# EAGLE board A20-SOM-EVB_Rev_B (EAGLE 4.16), part 1 of 3
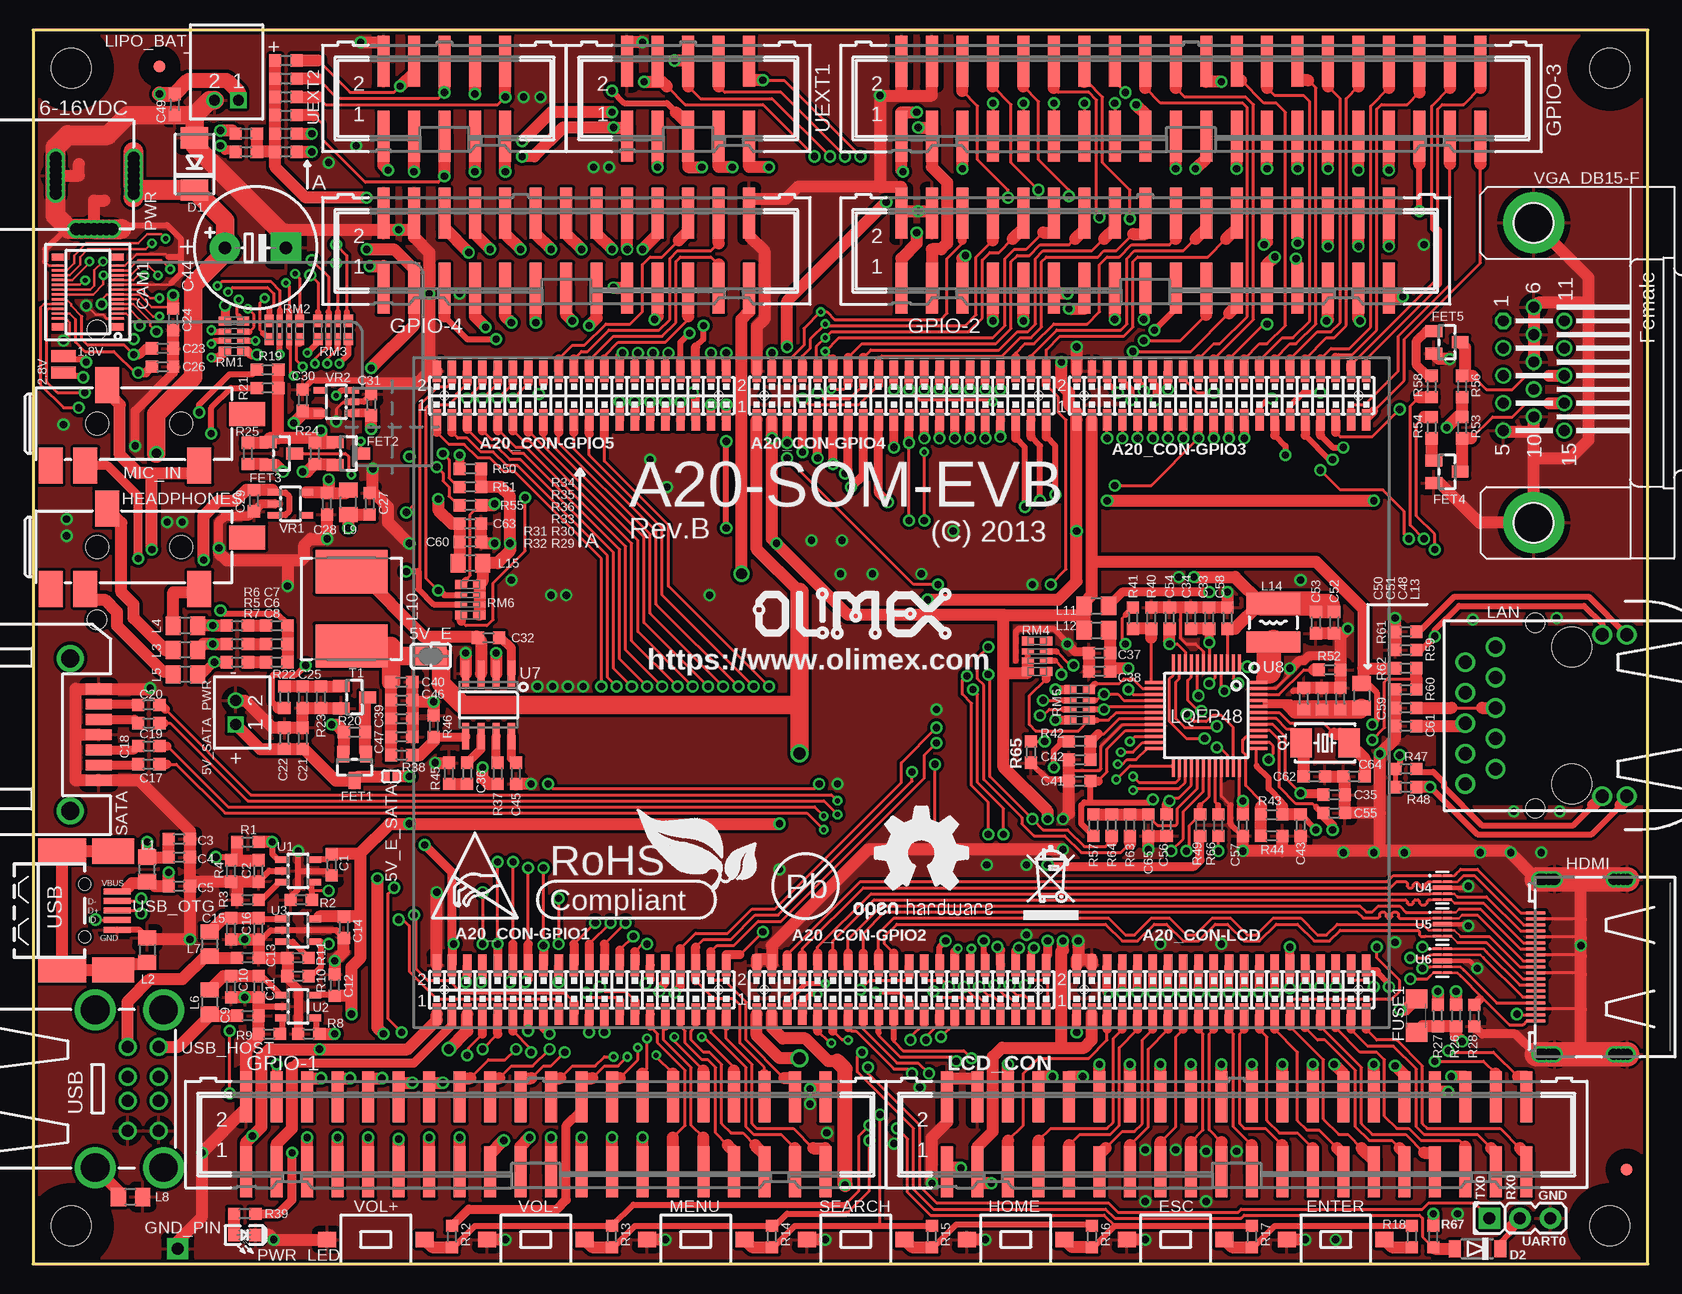
[diagram p5: board, top side]
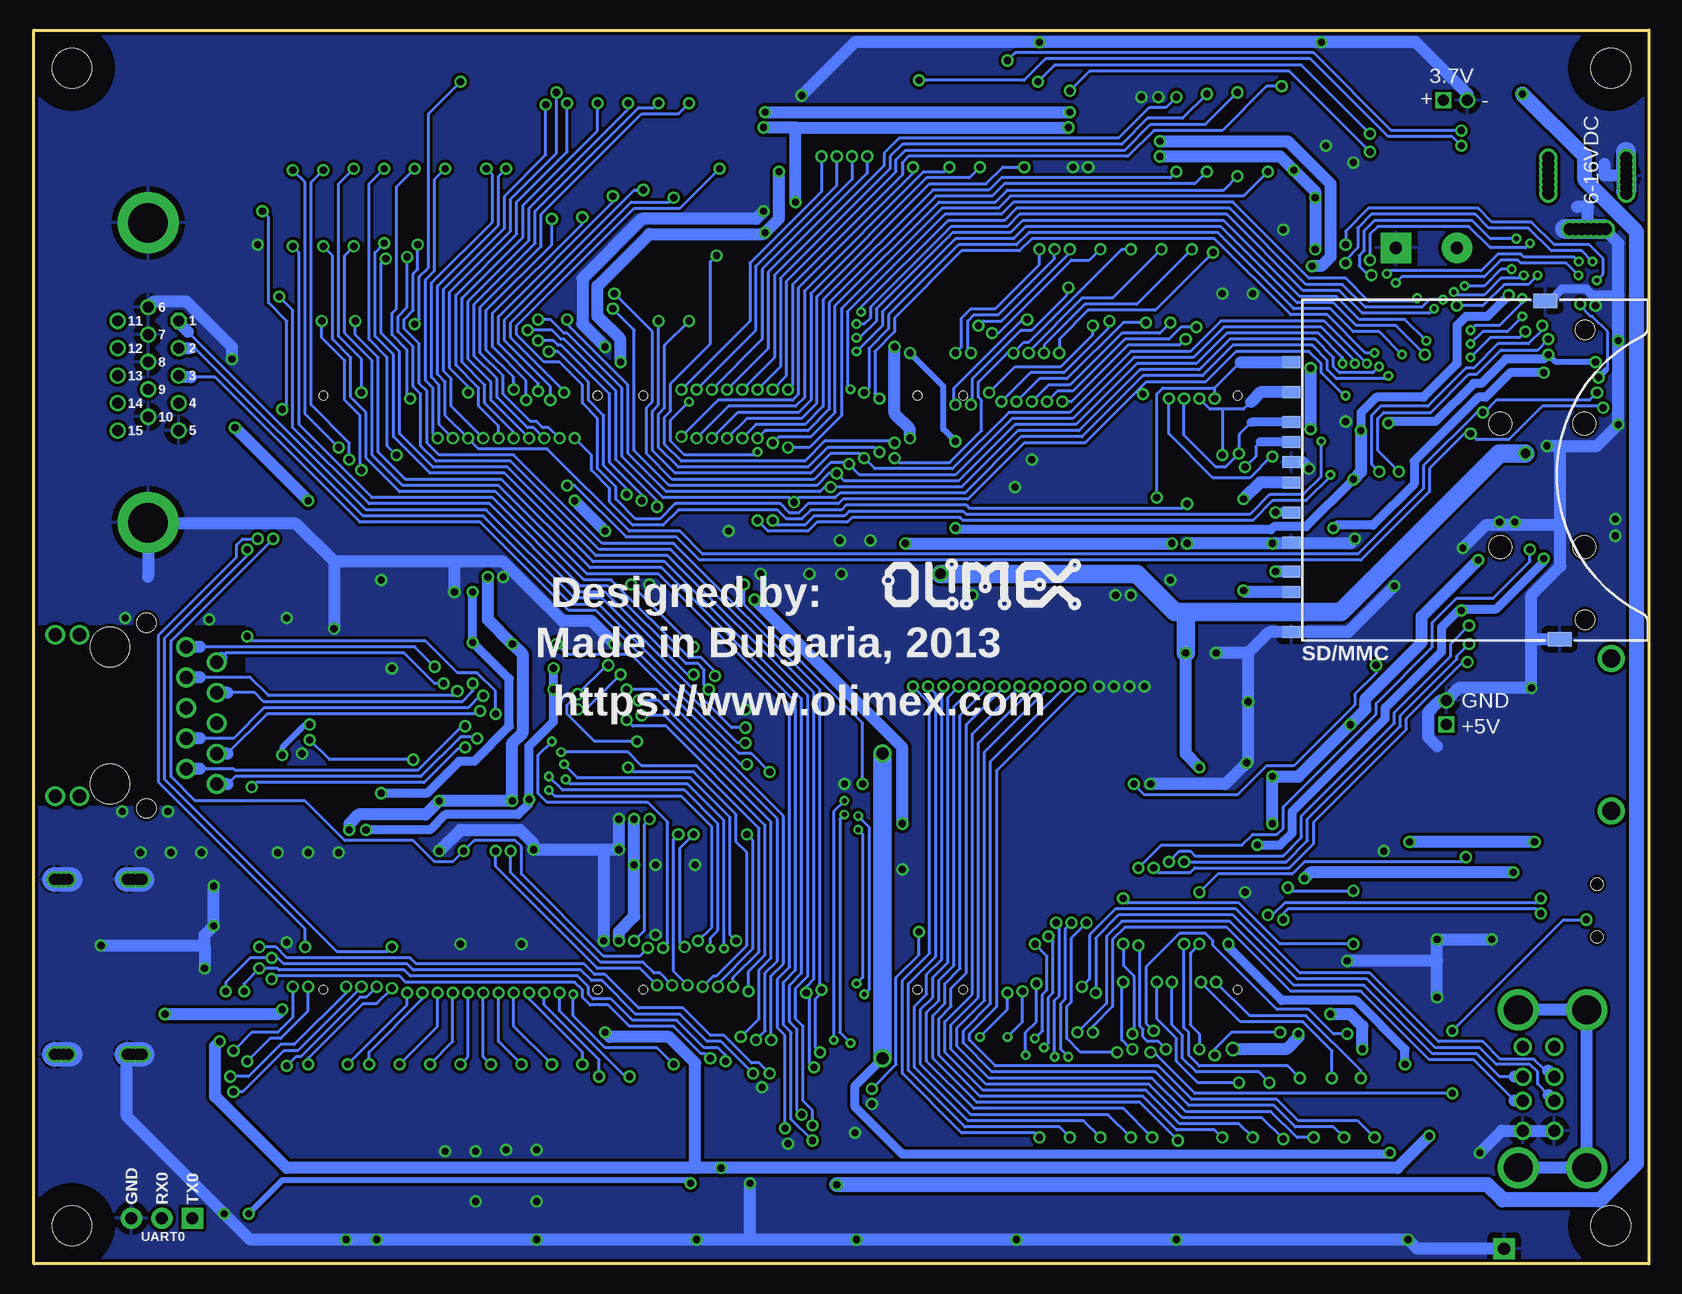
[diagram p6: board, bottom side, seen from below]

Size 134.62 x 102.87 mm. Coordinates in mm from the lower left corner, seen from the top.
Outline: 0,102.87 0,0 134.62,0 134.62,102.87 0,102.87
Copper layers (1+16): Top 0.035mm / dielectric 1.5mm / Bottom 0.035mm
Design rules "default": minimum track width 8mil, minimum drill 0.4mm, track to track 7mil, track to pad 7mil, pad to pad 7mil, via to via 7mil, smd to smd 1mil, copper to edge 10mil, drill to drill 8mil, minimum pad ring 8mil, minimum via ring 8mil, stop-mask expansion 4mil, vias tented up to drill 25mil, thermal gap 20mil
Holes 3.3 mm at 3.17,3.17 131.44,3.17 131.44,99.69 3.17,99.69
tRestrict: area 0,0 to 6.3,6.3; area 128.3,0 to 134.6,6.3; area 128.3,96.5 to 134.6,102.9; area 0,96.5 to 6.3,102.9
bRestrict: area 0,0 to 6.3,6.3; area 128.3,0 to 134.6,6.3; area 128.3,96.5 to 134.6,102.9; area 0,96.5 to 6.3,102.9

## Footprints (pad centres in the part's own frame; a part is rotated, then mirrored left to right if it is on the bottom)
SMD80/40 = smd 2.032 x 1.016: P$1 0,0
SJ-CLOSE = smd 1.168 x 1.6: 1 -0.762,0; 2 0.762,0
SJ_1_SMALLER = smd 0.508 x 0.762: 1 -0.381,0; 2 0.381,0
DW02S = drill 0.9 square: 1 -1,0 | drill 0.9 round: 2 1,0
A20-SOM-EVB = smd 0.7 x 1.8: 1-1 -38.735,-26.797; 1-2 -38.735,-22.733; 1-3 -37.465,-26.797; 1-4 -37.465,-22.733; 1-5 -36.195,-26.797; 1-6 -36.195,-22.733; 1-7 -34.925,-26.797; 1-8 -34.925,-22.733; 1-9 -33.655,-26.797; 1-10 -33.655,-22.733; 1-11 -32.385,-26.797; 1-12 -32.385,-22.733; 1-13 -31.115,-26.797; 1-14 -31.115,-22.733; 1-15 -29.845,-26.797; 1-16 -29.845,-22.733; 1-17 -28.575,-26.797; 1-18 -28.575,-22.733; 1-19 -27.305,-26.797; 1-20 -27.305,-22.733; 1-21 -26.035,-26.797; 1-22 -26.035,-22.733; 1-23 -24.765,-26.797; 1-24 -24.765,-22.733; 1-25 -23.495,-26.797; 1-26 -23.495,-22.733; 1-27 -22.225,-26.797; 1-28 -22.225,-22.733; 1-29 -20.955,-26.797; 1-30 -20.955,-22.733; 1-31 -19.685,-26.797; 1-32 -19.685,-22.733; 1-33 -18.415,-26.797; 1-34 -18.415,-22.733; 1-35 -17.145,-26.797; 1-36 -17.145,-22.733; 1-37 -15.875,-26.797; 1-38 -15.875,-22.733; 1-39 -14.605,-26.797; 1-40 -14.605,-22.733; 2-1 -12.065,-26.797; 2-2 -12.065,-22.733; 2-3 -10.795,-26.797; 2-4 -10.795,-22.733; 2-5 -9.525,-26.797; 2-6 -9.525,-22.733; 2-7 -8.255,-26.797; 2-8 -8.255,-22.733; 2-9 -6.985,-26.797; 2-10 -6.985,-22.733; 2-11 -5.715,-26.797; 2-12 -5.715,-22.733; 2-13 -4.445,-26.797; 2-14 -4.445,-22.733; 2-15 -3.175,-26.797; 2-16 -3.175,-22.733; 2-17 -1.905,-26.797; 2-18 -1.905,-22.733; 2-19 -0.635,-26.797; 2-20 -0.635,-22.733; 2-21 0.635,-26.797; 2-22 0.635,-22.733; 2-23 1.905,-26.797; 2-24 1.905,-22.733; 2-25 3.175,-26.797; 2-26 3.175,-22.733; 2-27 4.445,-26.797; 2-28 4.445,-22.733; 2-29 5.715,-26.797; 2-30 5.715,-22.733; 2-31 6.985,-26.797; 2-32 6.985,-22.733; 2-33 8.255,-26.797; 2-34 8.255,-22.733; 2-35 9.525,-26.797; 2-36 9.525,-22.733; 2-37 10.795,-26.797; 2-38 10.795,-22.733; 2-39 12.065,-26.797; 2-40 12.065,-22.733; 3-1 14.605,22.733; 3-2 14.605,26.797; 3-3 15.875,22.733; 3-4 15.875,26.797; 3-5 17.145,22.733; 3-6 17.145,26.797; 3-7 18.415,22.733; 3-8 18.415,26.797; 3-9 19.685,22.733; 3-10 19.685,26.797; 3-11 20.955,22.733; 3-12 20.955,26.797; 3-13 22.225,22.733; 3-14 22.225,26.797; 3-15 23.495,22.733; 3-16 23.495,26.797; 3-17 24.765,22.733; 3-18 24.765,26.797; 3-19 26.035,22.733; 3-20 26.035,26.797; 3-21 27.305,22.733; 3-22 27.305,26.797; 3-23 28.575,22.733; 3-24 28.575,26.797; 3-25 29.845,22.733; 3-26 29.845,26.797; 3-27 31.115,22.733; 3-28 31.115,26.797; 3-29 32.385,22.733; 3-30 32.385,26.797; 3-31 33.655,22.733; 3-32 33.655,26.797; 3-33 34.925,22.733; 3-34 34.925,26.797; 3-35 36.195,22.733; 3-36 36.195,26.797; 3-37 37.465,22.733; 3-38 37.465,26.797; 3-39 38.735,22.733; 3-40 38.735,26.797; 4-1 -12.065,22.733; 4-2 -12.065,26.797; 4-3 -10.795,22.733; 4-4 -10.795,26.797; 4-5 -9.525,22.733; 4-6 -9.525,26.797; 4-7 -8.255,22.733; 4-8 -8.255,26.797; 4-9 -6.985,22.733; 4-10 -6.985,26.797; 4-11 -5.715,22.733; 4-12 -5.715,26.797; 4-13 -4.445,22.733; 4-14 -4.445,26.797; 4-15 -3.175,22.733; 4-16 -3.175,26.797; 4-17 -1.905,22.733; 4-18 -1.905,26.797; 4-19 -0.635,22.733; 4-20 -0.635,26.797; 4-21 0.635,22.733; 4-22 0.635,26.797; 4-23 1.905,22.733; 4-24 1.905,26.797; 4-25 3.175,22.733; 4-26 3.175,26.797; 4-27 4.445,22.733; 4-28 4.445,26.797; 4-29 5.715,22.733; 4-30 5.715,26.797; 4-31 6.985,22.733; 4-32 6.985,26.797; 4-33 8.255,22.733; 4-34 8.255,26.797; 4-35 9.525,22.733; 4-36 9.525,26.797; 4-37 10.795,22.733; 4-38 10.795,26.797; 4-39 12.065,22.733; 4-40 12.065,26.797; 5-1 -38.735,22.733; 5-2 -38.735,26.797; 5-3 -37.465,22.733; 5-4 -37.465,26.797; 5-5 -36.195,22.733; 5-6 -36.195,26.797; 5-7 -34.925,22.733; 5-8 -34.925,26.797; 5-9 -33.655,22.733; 5-10 -33.655,26.797; 5-11 -32.385,22.733; 5-12 -32.385,26.797; 5-13 -31.115,22.733; 5-14 -31.115,26.797; 5-15 -29.845,22.733; 5-16 -29.845,26.797; 5-17 -28.575,22.733; 5-18 -28.575,26.797; 5-19 -27.305,22.733; 5-20 -27.305,26.797; 5-21 -26.035,22.733; 5-22 -26.035,26.797; 5-23 -24.765,22.733; 5-24 -24.765,26.797; 5-25 -23.495,22.733; 5-26 -23.495,26.797; 5-27 -22.225,22.733; 5-28 -22.225,26.797; 5-29 -20.955,22.733; 5-30 -20.955,26.797; 5-31 -19.685,22.733; 5-32 -19.685,26.797; 5-33 -18.415,22.733; 5-34 -18.415,26.797; 5-35 -17.145,22.733; 5-36 -17.145,26.797; 5-37 -15.875,22.733; 5-38 -15.875,26.797; 5-39 -14.605,22.733; 5-40 -14.605,26.797; LCD-1 14.605,-26.797; LCD-2 14.605,-22.733; LCD-3 15.875,-26.797; LCD-4 15.875,-22.733; LCD-5 17.145,-26.797; LCD-6 17.145,-22.733; LCD-7 18.415,-26.797; LCD-8 18.415,-22.733; LCD-9 19.685,-26.797; LCD-10 19.685,-22.733; LCD-11 20.955,-26.797; LCD-12 20.955,-22.733; LCD-13 22.225,-26.797; LCD-14 22.225,-22.733; LCD-15 23.495,-26.797; LCD-16 23.495,-22.733; LCD-17 24.765,-26.797; LCD-18 24.765,-22.733; LCD-19 26.035,-26.797; LCD-20 26.035,-22.733; LCD-21 27.305,-26.797; LCD-22 27.305,-22.733; LCD-23 28.575,-26.797; LCD-24 28.575,-22.733; LCD-25 29.845,-26.797; LCD-26 29.845,-22.733; LCD-27 31.115,-26.797; LCD-28 31.115,-22.733; LCD-29 32.385,-26.797; LCD-30 32.385,-22.733; LCD-31 33.655,-26.797; LCD-32 33.655,-22.733; LCD-33 34.925,-26.797; LCD-34 34.925,-22.733; LCD-35 36.195,-26.797; LCD-36 36.195,-22.733; LCD-37 37.465,-26.797; LCD-38 37.465,-22.733; LCD-39 38.735,-26.797; LCD-40 38.735,-22.733 | hole 0.7: -38.1,-24.765; -15.24,-24.765; -11.43,24.765; 11.43,24.765; 15.24,24.765; 38.1,24.765; -11.43,-24.765; 11.43,-24.765; -38.1,24.765; -15.24,24.765; 15.24,-24.765; 38.1,-24.765
C0603_DWS = smd 1.016 x 1.016: 1 -0.889,0; 2 0.889,0
E5-10,5 = drill 1.016 pad 2.54 round: + -2.54,0 | drill 1.016 pad 2.54 square: - 2.54,0
CAM_2M_GT2005 = smd 0.2 x 1: 1 -2.2,-2.5; 2 -2.2,2.5; 3 -1.8,-2.5; 4 -1.8,2.5; 5 -1.4,-2.5; 6 -1.4,2.5; 7 -1,-2.5; 8 -1,2.5; 9 -0.6,-2.5; 10 -0.6,2.5; 11 -0.2,-2.5; 12 -0.2,2.5; 13 0.2,-2.5; 14 0.2,2.5; 15 0.6,-2.5; 16 0.6,2.5; 17 1,-2.5; 18 1,2.5; 19 1.4,-2.5; 20 1.4,2.5; 21 1.8,-2.5; 22 1.8,2.5; 23 2.2,-2.5; 24 2.2,2.5 | smd 0.6 x 1: MP1 -2.9,-2.5; MP2 -2.9,2.5; MP3 2.9,-2.5; MP4 2.9,2.5
DO214AA = smd 1.778 x 2.286: A 2.177,0; C -2.177,0
SOD-123 = smd 1 x 1.4: A 1.9,0; C -1.9,0
SW-TAKT_6X3.5_SMD = smd 1.27 x 1.524: P$1 0,4.064; P$2 0,-4.064
SOT23 = smd 1 x 1.4: 1 -0.95,-1.1; 2 0.95,-1.1; 3 0,1.1
FIDUCIAL-1X3 = smd 1 x 1: 1 0,0
1206 = smd 1.6 x 1.8: 1 -1.4,0; 2 1.4,0
TEST_PAD40/70/SQUARE = drill 1.016 pad 1.778 square: P$1 0,0
ML40-MALE(GBH-254-SMT-40) = smd 1 x 4.25: 1 -24.13,-3.125; 2 -24.13,3.125; 3 -21.59,-3.125; 4 -21.59,3.125; 5 -19.05,-3.125; 6 -19.05,3.125; 7 -16.51,-3.125; 8 -16.51,3.125; 9 -13.97,-3.125; 10 -13.97,3.125; 11 -11.43,-3.125; 12 -11.43,3.125; 13 -8.89,-3.125; 14 -8.89,3.125; 15 -6.35,-3.125; 16 -6.35,3.125; 17 -3.81,-3.125; 18 -3.81,3.125; 19 -1.27,-3.125; 20 -1.27,3.125; 21 1.27,-3.125; 22 1.27,3.125; 23 3.81,-3.125; 24 3.81,3.125; 25 6.35,-3.125; 26 6.35,3.125; 27 8.89,-3.125; 28 8.89,3.125; 29 11.43,-3.125; 30 11.43,3.125; 31 13.97,-3.125; 32 13.97,3.125; 33 16.51,-3.125; 34 16.51,3.125; 35 19.05,-3.125; 36 19.05,3.125; 37 21.59,-3.125; 38 21.59,3.125; 39 24.13,-3.125; 40 24.13,3.125
ML34-MALE(GBH-254-SMT-34) = smd 1 x 4.25: 1 -20.32,-3.125; 2 -20.32,3.125; 3 -17.78,-3.125; 4 -17.78,3.125; 5 -15.24,-3.125; 6 -15.24,3.125; 7 -12.7,-3.125; 8 -12.7,3.125; 9 -10.16,-3.125; 10 -10.16,3.125; 11 -7.62,-3.125; 12 -7.62,3.125; 13 -5.08,-3.125; 14 -5.08,3.125; 15 -2.54,-3.125; 16 -2.54,3.125; 17 0,-3.125; 18 0,3.125; 19 2.54,-3.125; 20 2.54,3.125; 21 5.08,-3.125; 22 5.08,3.125; 23 7.62,-3.125; 24 7.62,3.125; 25 10.16,-3.125; 26 10.16,3.125; 27 12.7,-3.125; 28 12.7,3.125; 29 15.24,-3.125; 30 15.24,3.125; 31 17.78,-3.125; 32 17.78,3.125; 33 20.32,-3.125; 34 20.32,3.125
ML26-MALE(GBH-254-SMT-26) = smd 1 x 4.25: 1 -15.24,-3.125; 2 -15.24,3.125; 3 -12.7,-3.125; 4 -12.7,3.125; 5 -10.16,-3.125; 6 -10.16,3.125; 7 -7.62,-3.125; 8 -7.62,3.125; 9 -5.08,-3.125; 10 -5.08,3.125; 11 -2.54,-3.125; 12 -2.54,3.125; 13 0,-3.125; 14 0,3.125; 15 2.54,-3.125; 16 2.54,3.125; 17 5.08,-3.125; 18 5.08,3.125; 19 7.62,-3.125; 20 7.62,3.125; 21 10.16,-3.125; 22 10.16,3.125; 23 12.7,-3.125; 24 12.7,3.125; 25 15.24,-3.125; 26 15.24,3.125
HDMI-SWM-19 = smd 1.6 x 0.28: 1 0.8,4.5; 2 0.8,4; 3 0.8,3.5; 4 0.8,3; 5 0.8,2.5; 6 0.8,2; 7 0.8,1.5; 8 0.8,1; 9 0.8,0.5; 10 0.8,0; 11 0.8,-0.5; 12 0.8,-1; 13 0.8,-1.5; 14 0.8,-2; 15 0.8,-2.5; 16 0.8,-3; 17 0.8,-3.5; 18 0.8,-4; 19 0.8,-4.5 | drill 0.9 round: P$5 1.5,7.3; P$7 7.7,7.3; P$9 7.7,-7.3; P$11 1.5,-7.3; P$13 1.9,7.3; P$15 8.1,7.3; P$18 8.1,-7.3; P$20 1.9,-7.3; P$21 2.2,7.3; P$22 1.4,7.3; P$23 1.4,-7.3; P$24 2.2,-7.3; P$25 1.1,7.3; P$26 1.1,-7.3; P$27 7.3,-7.3; P$28 7.3,7.3; SH1 2.4,7.3; SH2 8.45,7.3; SH3 8.45,-7.3; SH4 2.4,-7.3
PJ-W47S-05D2-LF_5PIN_V2 = smd 2 x 3: 1 2.1,-0.5; 2 14.5,-0.5; 3 6.8,6.2; 5 5,-0.5 | smd 3 x 2: 4 18.5,3.8 | hole 1.9: 6,3; 13,3
L0805_5MIL_DWS = smd 1.27 x 1.524: 1 -1.016,0; 2 1.016,0
8X8MM_3131 = smd 3.6 x 6: 1 -3.1,0; 2 3.1,0
CD42(43) = smd 4.5 x 1.75: 1 0,1.6; 2 0,-1.6
TM211Q01FM22 = drill 1.1 round: 1 -5.715,-6.35; 2 -4.445,-8.89; 3 -3.175,-6.35; 4 -1.905,-8.89; 5 -0.635,-6.35; 6 0.635,-8.89; 7 1.905,-6.35; 8 3.175,-8.89; 9 4.445,-6.35; 10 5.715,-8.89; 11 -6.731,2.54; 12 -6.731,4.572; 13 6.731,2.54; 14 6.731,4.572 | hole 3.3: 5.715,0; -5.715,0 | hole 1.6: 7.747,-3.048; -7.747,-3.048
DW02R = drill 0.9 square: 1 -1,0 | drill 0.9 round: 2 1,0
PWR_JACK_UNI_MILLING = drill 1 round: + 0,4.75; +1 0,5.25; +2 0,5.75; +3 0,6.25; +4 0,4.25; +5 0,3.75; +6 0,3.25; - -6.5,4.75; -1 -6.5,5.25; -2 -6.5,5.75; -3 -6.5,4.25; -4 -6.5,3.75; -5 -6.5,6.25; -6 -6.5,3.25; -- -3.3,0.3; --1 -3.8,0.3; --2 -4.3,0.3; --3 -4.8,0.3; --4 -2.8,0.3; --5 -2.3,0.3; --6 -1.8,0.3
LED-0603 = smd 1.016 x 1.016: A 0.889,0; C -0.889,0
HCX-4S = smd 1.8 x 2.4: 1 -2,0; 2 2,0
R0603_5MIL_DWS = smd 1.016 x 1.016: 1 -0.889,0; 2 0.889,0
R_MATRIX_4 = smd 1.016 x 0.762: 1.1 -0.762,1.27; 1.2 0.762,1.27; 4.1 -0.762,-1.27; 4.2 0.762,-1.27 | smd 1.016 x 0.508: 2.1 -0.762,0.381; 2.2 0.762,0.381; 3.1 -0.762,-0.381; 3.2 0.762,-0.381
SATA-PWA-07 = smd 0.9 x 2.2: 1 4.5,1; 2 5.77,1; 3 7.04,1; 4 8.31,1; 5 9.58,1; 6 10.85,1; 7 12.12,1 | drill 1.5 round: P$8 1.94,3.36; P$9 14.68,3.36
SD_CARD = smd 1 x 1.5: 1 6.88,15.3; 2 4.38,15.3; 3 1.08,15.3; 4 -0.63,15.3; 5 -3.13,15.3; 6 -5.63,15.3; 7 -8.06,15.3; 8 -9.76,15.3; 9 9.38,15.3; CD 2.73,15.3; WP -13.11,15.3 | smd 1.2 x 2: SH1 -13.7,-7.05; SH2 14.5,-5.85 | hole 1.6: -12.09,-9.15; 12.1,-9.15
SOT23-5 = smd 0.55 x 1.2: 1 -0.95,-1.3; 2 0,-1.3; 3 0.95,-1.3; 4 0.95,1.3; 5 -0.95,1.3
SLP2510P8 = smd 0.2 x 0.675: 1 -1,-0.438; 2 -0.5,-0.438; 4 0.5,-0.438; 5 1,-0.438; 6 1,0.438; 7 0.5,0.438; 9 -0.5,0.438; 10 -1,0.438 | smd 0.4 x 0.775: 3 0,-0.388; 8 0,0.388
SOIC8 = smd 0.6 x 2.2: 1 -1.905,-2.6; 2 -0.635,-2.6; 3 0.635,-2.6; 4 1.905,-2.6; 5 1.905,2.6; 6 0.635,2.6; 7 -0.635,2.6; 8 -1.905,2.6
LQFP48 = smd 0.254 x 1.6: 1 -2.75,-4.3; 2 -2.25,-4.3; 3 -1.75,-4.3; 4 -1.25,-4.3; 5 -0.75,-4.3; 6 -0.25,-4.3; 7 0.25,-4.3; 8 0.75,-4.3; 9 1.25,-4.3; 10 1.75,-4.3; 11 2.25,-4.3; 12 2.75,-4.3; 25 2.75,4.3; 26 2.25,4.3; 27 1.75,4.3; 28 1.25,4.3; 29 0.75,4.3; 30 0.25,4.3; 31 -0.25,4.3; 32 -0.75,4.3; 33 -1.25,4.3; 34 -1.75,4.3; 35 -2.25,4.3; 36 -2.75,4.3 | smd 1.6 x 0.254: 13 4.3,-2.75; 14 4.3,-2.25; 15 4.3,-1.75; 16 4.3,-1.25; 17 4.3,-0.75; 18 4.3,-0.25; 19 4.3,0.25; 20 4.3,0.75; 21 4.3,1.25; 22 4.3,1.75; 23 4.3,2.25; 24 4.3,2.75; 37 -4.3,2.75; 38 -4.3,2.25; 39 -4.3,1.75; 40 -4.3,1.25; 41 -4.3,0.75; 42 -4.3,0.25; 43 -4.3,-0.25; 44 -4.3,-0.75; 45 -4.3,-1.25; 46 -4.3,-1.75; 47 -4.3,-2.25; 48 -4.3,-2.75
HN1X3 = drill 1 pad 1.778 square: 1 -2.54,0 | drill 1 pad 1.778 round: 2 0,0; 3 2.54,0
ML10_S = smd 1 x 4.25: 1 -5.08,-3.125; 2 -5.08,3.125; 3 -2.54,-3.125; 4 -2.54,3.125; 5 0,-3.125; 6 0,3.125; 7 2.54,-3.125; 8 2.54,3.125; 9 5.08,-3.125; 10 5.08,3.125
USB_TWO_LEVEL = drill 1 round: 1.1 -3.5,2.62; 1.2 -1,2.62; 1.3 1,2.62; 1.4 3.5,2.62; 2.1 -3.5,0; 2.2 -1,0; 2.3 1,0; 2.4 3.5,0 | drill 2.4 round: GND1 -6.57,-2.7; GND2 6.57,-2.7; GND3 6.57,3; GND4 -6.57,3
USB_MINI_9PIN = smd 2.25 x 0.5: D+ 2.706,0; D- 2.706,0.8; GND 2.706,-1.6; ID 2.706,-0.8; VBUS 2.706,1.6 | smd 4 x 2.1: GND1 -1.9,4.95; GND3 -1.9,-4.95 | smd 3.5 x 2.1: GND2 2.35,4.95; GND4 2.35,-4.95 | hole 1: 0,2.2; 0,-2.2
DB15-F_22MM = drill 0.9 octagon: 1 4.329,6.35 | drill 0.9 round: 2 2.043,6.35; 3 -0.243,6.35; 4 -2.529,6.35; 5 -4.815,6.35; 6 5.472,3.81; 7 3.186,3.81; 8 0.9,3.81; 9 -1.386,3.81; 10 -3.672,3.81; 11 4.329,1.27; 12 2.043,1.27; 13 -0.243,1.27; 14 -2.529,1.27; 15 -4.815,1.27 | drill 3.302 pad 5.08 round: GND1 -12.497,3.81; GND2 12.497,3.81
SOT-23-5 = smd 0.55 x 1.2: 1 -0.95,-1.3; 2 0,-1.3; 3 0.95,-1.3; 4 0.95,1.3; 5 -0.95,1.3

## Placement (x,y rotation side)
1.8V  TESTPAD80/40  [SMD80/40]  2.54,75.69 0 top
2.8V  TESTPAD80/40  [SMD80/40]  2.54,74.3 0 top
5V_E  Close  [SJ-CLOSE]  33.15,50.67 0 top
5V_E_SATA  [SJ_1_SMALLER]  29.84,40.64 180 top
5V_SATA_PWR  DW02S  [DW02S]  16.89,45.97 90 top
A20-SOM-EVB_PLATFORM  6XGPH127SMT-02X20(PA-V16X-2X20-LF)  [A20-SOM-EVB]  72.39,47.62 0 top
C1  22uF/6.3V  [C0603_DWS]  24.89,33.27 270 top
C2  100nF  [C0603_DWS]  18.8,32.77 270 top
C3  22uF/6.3V  [C0603_DWS]  12.19,35.43 0 top
C4  22uF/6.3V  [C0603_DWS]  12.19,33.91 0 top
C5  100nF  [C0603_DWS]  12.19,31.5 0 top
C6  100nF  [C0603_DWS]  20.32,51.69 180 top
C7  100nF  [C0603_DWS]  20.32,53.21 180 top
C8  100nF  [C0603_DWS]  20.32,50.16 180 top
C9  100nF  [C0603_DWS]  17.91,20.7 0 top
C10  22uF/6.3V  [C0603_DWS]  16.51,23.11 270 top
C11  22uF/6.3V  [C0603_DWS]  18.8,23.11 270 top
C12  22uF/6.3V  [C0603_DWS]  25.15,23.24 90 top
C13  100nF  [C0603_DWS]  17.91,25.53 0 top
C14  22uF/6.3V  [C0603_DWS]  25.91,28.07 270 top
C15  22uF/6.3V  [C0603_DWS]  16.51,27.94 270 top
C16  22uF/6.3V  [C0603_DWS]  18.8,27.94 270 top
C17  10nF  [C0603_DWS]  9.65,41.66 180 top
C18  10nF  [C0603_DWS]  9.65,43.18 180 top
C19  10nF  [C0603_DWS]  9.65,45.09 180 top
C20  10nF  [C0603_DWS]  9.65,46.61 180 top
C21  22uF/6.3V  [C0603_DWS]  22.48,43.81 270 top
C22  NA(22uF/6.3V)  [C0603_DWS]  20.95,43.81 270 top
C23  100nF  [C0603_DWS]  10.79,76.33 0 top
C24  100nF  [C0603_DWS]  11.68,78.74 270 top
C25  100nF  [C0603_DWS]  22.48,47.24 270 top
C26  100nF  [C0603_DWS]  10.79,74.8 0 top
C27  22uF/6.3V  [C0603_DWS]  28.07,63.37 90 top
C28  22uF/6.3V  [C0603_DWS]  24.51,63.37 270 top
C29  22uF/6.3V  [C0603_DWS]  18.41,63.63 270 top
C30  22uF/6.3V  [C0603_DWS]  22.48,72.01 90 top
C31  22uF/6.3V  [C0603_DWS]  28.19,71.63 90 top
C32  10nF  [C0603_DWS]  37.97,52.2 180 top
C33  22uF/6.3V  [C0603_DWS]  98.04,53.85 270 top
C34  100nF  [C0603_DWS]  96.52,53.85 270 top
C35  100nF  [C0603_DWS]  108.46,39.12 180 top
C36  3.3nF  [C0603_DWS]  36.2,40.89 270 top
C37  22uF/6.3V  [C0603_DWS]  88.9,50.93 0 top
C38  100nF  [C0603_DWS]  88.9,49.4 0 top
C39  22uF/6.3V  [C0603_DWS]  30.73,45.47 0 top
C40  22uF/6.3V  [C0603_DWS]  30.73,48.51 0 top
C41  100nF  [C0603_DWS]  87.25,40.26 0 top
C42  NA  [C0603_DWS]  87.25,42.04 180 top
C43  100nF  [C0603_DWS]  105.66,36.58 90 top
C44  470uF/25V/LOWESR/105C  [E5-10,5]  18.54,84.71 0 top
C45  100nF  [C0603_DWS]  40.26,40.89 270 top
C46  22uF/6.3V  [C0603_DWS]  30.73,46.99 0 top
C47  22uF/6.3V  [C0603_DWS]  30.73,43.94 0 top
C48  22uF/6.3V  [C0603_DWS]  108.97,47.12 270 top
C49  22uF/6.3V  [C0603_DWS]  11.81,96.65 90 top
C50  22uF/6.3V  [C0603_DWS]  105.92,47.12 270 top
C51  22uF/6.3V  [C0603_DWS]  107.44,47.12 270 top
C52  22uF/6.3V  [C0603_DWS]  108.46,53.47 90 top
C53  22uF/6.3V  [C0603_DWS]  106.93,53.47 90 top
C54  100nF  [C0603_DWS]  94.74,53.85 270 top
C55  100nF  [C0603_DWS]  108.46,37.59 180 top
C56  100nF  [C0603_DWS]  94.49,36.58 90 top
C57  100nF  [C0603_DWS]  100.84,36.58 90 top
C58  100nF  [C0603_DWS]  99.57,53.85 270 top
C59  100nF  [C0603_DWS]  114.43,46.35 0 top
C60  22uF/6.3V  [C0603_DWS]  36.45,60.2 180 top
C61  100nF  [C0603_DWS]  114.43,44.83 0 top
C62  27pF  [C0603_DWS]  106.81,40.64 180 top
C63  22uF/6.3V  [C0603_DWS]  36.45,61.72 180 top
C64  27pF  [C0603_DWS]  110.11,40.64 0 top
C65  100n  [C0603_DWS]  92.96,36.58 90 top
CAM1  CAMERA_2M-GT2005  [CAM_2M_GT2005]  4.57,81.03 90 top
D1  SMBJ16A  [DO214AA]  13.46,91.69 90 top
D2  1N5819(S4SOD-123)  [SOD-123]  120.4,1.27 180 top
ENTER  SW-TAKT6  [SW-TAKT_6X3.5_SMD]  108.58,2.03 90 top
ESC  SW-TAKT6  [SW-TAKT_6X3.5_SMD]  95.25,2.03 90 top
FET1  IRLML6402  [SOT23]  26.8,41.4 180 top
FET2  BSS138  [SOT23]  26.29,67.56 270 top
FET3  BSS138  [SOT23]  20.7,67.56 270 top
FET4  BSS138  [SOT23]  117.86,66.04 270 top
FET5  BSS138  [SOT23]  117.86,76.83 270 top
FID1  FIDUCIAL  [FIDUCIAL-1X3]  10.54,99.82 180 top
FID2  FIDUCIAL  [FIDUCIAL-1X3]  132.84,7.87 180 top
FUSE1  FSMD035  [1206]  115.32,20.7 90 top
GND_PIN  TESTPAD3  [TEST_PAD40/70/SQUARE]  12.06,1.27 0 top
GPIO-1  HN2x20  [ML40-MALE(GBH-254-SMT-40)]  41.91,10.79 0 top
GPIO-2  HN2x20  [ML34-MALE(GBH-254-SMT-34)]  92.71,84.45 0 top
GPIO-3  HN2x20  [ML40-MALE(GBH-254-SMT-40)]  96.52,97.16 0 top
GPIO-4  HN2x13  [ML26-MALE(GBH-254-SMT-26)]  44.45,84.45 0 top
HDMI  HDMI-SWM-19  [HDMI-SWM-19]  124.46,24.77 0 top
HEADPHONES  PJ-W47S-05D2-LF_V2  [PJ-W47S-05D2-LF_5PIN_V2]  -0.64,56.77 0 top
HOME  SW-TAKT6  [SW-TAKT_6X3.5_SMD]  81.92,2.03 90 top
L1  FB0805/600R/2A  [L0805_5MIL_DWS]  9.53,32.89 90 top
L2  FB0805/600R/200mA(201209-601)  [L0805_5MIL_DWS]  9.53,26.16 270 top
L3  FB0805/600R/200mA(201209-601)  [L0805_5MIL_DWS]  12.7,51.18 180 top
L4  FB0805/600R/200mA(201209-601)  [L0805_5MIL_DWS]  12.7,53.21 180 top
L5  FB0805/600R/200mA(201209-601)  [L0805_5MIL_DWS]  12.7,49.15 180 top
L6  FB0805/600R/2A  [L0805_5MIL_DWS]  14.73,21.84 270 top
L7  FB0805/600R/2A  [L0805_5MIL_DWS]  14.73,26.67 270 top
L8  FB0805/600R/200mA(201209-601)  [L0805_5MIL_DWS]  8.13,5.59 180 top
L9  FB/600R/2A  [L0805_5MIL_DWS]  26.29,63.5 90 top
L10  10uH/3.15A/20%  [8X8MM_3131]  26.54,54.61 270 top
L11  0R/0805  [L0805_5MIL_DWS]  88.65,54.86 0 top
L12  0R/0805  [L0805_5MIL_DWS]  88.65,52.83 0 top
L13  0R/0805  [L0805_5MIL_DWS]  110.74,47.37 270 top
L14  4.7uH/1.15A/DCR<0.1R/CD43  [CD42(43)]  103.38,53.47 180 top
L15  CL470nH/0805/0.3R/250mA  [L0805_5MIL_DWS]  36.45,58.42 180 top
LAN  TM211Q01FM22  [TM211Q01FM22]  128.27,45.72 270 top
LCD_CON  GPH-254-SMT-02x20  [ML40-MALE(GBH-254-SMT-40)]  100.33,10.79 0 top
LIPO_BAT  DW02R  [DW02R]  16.13,97.03 180 top
MENU  SW-TAKT6  [SW-TAKT_6X3.5_SMD]  55.24,2.03 90 top
MIC_IN  PJ-W47S-05D2-LF_V2  [PJ-W47S-05D2-LF_5PIN_V2]  -0.64,67.06 0 top
PWR  YDJ-1136  [PWR_JACK_UNI_MILLING]  8.38,85.98 0 top
PWR_LED  LED/RED/0603  [LED-0603]  17.65,2.41 180 top
Q1  E4SB25.000F20E15(25MHz/20pF/20ppm/5x3.2mm)  [HCX-4S]  107.7,43.43 180 top
R1  4.99k/1%  [R0603_5MIL_DWS]  17.91,35.18 0 top
R2  10k  [R0603_5MIL_DWS]  22.35,30.35 0 top
R3  13k/1%  [R0603_5MIL_DWS]  17.91,30.35 0 top
R4  10k  [R0603_5MIL_DWS]  16.51,32.77 90 top
R5  22R  [R0603_5MIL_DWS]  17.02,51.69 180 top
R6  22R  [R0603_5MIL_DWS]  17.02,53.21 180 top
R7  22R  [R0603_5MIL_DWS]  17.02,50.16 180 top
R8  10k  [R0603_5MIL_DWS]  22.99,19.18 0 top
R9  13k/1%  [R0603_5MIL_DWS]  19.68,19.18 0 top
R10  10k  [R0603_5MIL_DWS]  22.1,24 0 top
R11  13k/1%  [R0603_5MIL_DWS]  22.1,25.53 0 top
R12  6.81k/1%  [R0603_5MIL_DWS]  34.92,2.29 270 top
R13  8.25k/1%  [R0603_5MIL_DWS]  48.26,2.29 270 top
R14  10k/1%  [R0603_5MIL_DWS]  61.59,2.29 270 top
R15  11k/1%  [R0603_5MIL_DWS]  74.93,2.29 270 top
R16  13k/1%  [R0603_5MIL_DWS]  88.27,2.29 270 top
R17  16.2k/1%  [R0603_5MIL_DWS]  101.6,2.29 270 top
R18  22.1k/1%  [R0603_5MIL_DWS]  114.94,2.29 270 top
R19  10k  [R0603_5MIL_DWS]  19.56,74.55 0 top
R20  10k  [R0603_5MIL_DWS]  26.8,44.32 0 top
R21  10k  [R0603_5MIL_DWS]  19.56,73.03 0 top
R22  10k  [R0603_5MIL_DWS]  20.95,47.24 270 top
R23  4.99k/1%  [R0603_5MIL_DWS]  24,47.24 90 top
R24  2.2k  [R0603_5MIL_DWS]  23.5,67.56 90 top
R25  2.2k  [R0603_5MIL_DWS]  17.91,67.56 90 top
R26  2k/1%  [R0603_5MIL_DWS]  118.62,20.7 270 top
R27  2k/1%  [R0603_5MIL_DWS]  117.09,20.7 270 top
R28  10k  [R0603_5MIL_DWS]  120.14,20.7 270 top
R29  NA  [R0603_5MIL_DWS]  21.08,92.71 180 top
R30  NA  [R0603_5MIL_DWS]  21.08,94.23 180 top
R31  NA  [R0603_5MIL_DWS]  17.78,94.23 0 top
R32  NA  [R0603_5MIL_DWS]  17.78,92.71 0 top
R33  NA  [R0603_5MIL_DWS]  21.08,95.76 180 top
R34  NA  [R0603_5MIL_DWS]  21.08,100.33 180 top
R35  NA  [R0603_5MIL_DWS]  21.08,98.81 180 top
R36  NA  [R0603_5MIL_DWS]  21.08,97.28 180 top
R37  10k  [R0603_5MIL_DWS]  38.73,40.89 90 top
R38  4.99k/1%  [R0603_5MIL_DWS]  30.73,42.42 180 top
R39  2.2k  [R0603_5MIL_DWS]  17.65,4.19 180 top
R40  10k  [R0603_5MIL_DWS]  93.22,53.85 90 top
R41  22R  [R0603_5MIL_DWS]  91.69,53.85 90 top
R42  22R  [R0603_5MIL_DWS]  87.25,43.56 180 top
R43  10k  [R0603_5MIL_DWS]  103.25,37.47 180 top
R44  NA  [R0603_5MIL_DWS]  103.25,35.69 180 top
R45  2.2k  [R0603_5MIL_DWS]  34.67,40.89 90 top
R46  1.05k/1%  [R0603_5MIL_DWS]  33.4,44.83 90 top
R47  1k  [R0603_5MIL_DWS]  114.43,41.27 0 top
R48  4.7k  [R0603_5MIL_DWS]  114.43,39.75 180 top
R49  1k  [R0603_5MIL_DWS]  97.28,36.58 270 top
R50  10k  [R0603_5MIL_DWS]  36.45,66.29 0 top
R51  10k  [R0603_5MIL_DWS]  36.45,64.77 0 top
R52  2.49k/1%  [R0603_5MIL_DWS]  108.08,49.53 180 top
R53  390R  [R0603_5MIL_DWS]  119.13,69.72 270 top
R54  120R  [R0603_5MIL_DWS]  116.59,69.72 270 top
R55  1k  [R0603_5MIL_DWS]  36.45,63.25 0 top
R56  390R  [R0603_5MIL_DWS]  119.13,73.15 90 top
R57  470k  [R0603_5MIL_DWS]  88.39,36.58 90 top
R58  120R  [R0603_5MIL_DWS]  116.59,73.15 90 top
R59  4.7k  [R0603_5MIL_DWS]  114.43,51.18 0 top
R60  NA  [R0603_5MIL_DWS]  114.43,47.88 180 top
R61  1k  [R0603_5MIL_DWS]  114.43,52.7 0 top
R62  4.7k  [R0603_5MIL_DWS]  114.43,49.66 180 top
R63  NA  [R0603_5MIL_DWS]  91.44,36.58 90 top
R64  NA  [R0603_5MIL_DWS]  89.92,36.58 90 top
R65  NA(4.7k)  [R0603_5MIL_DWS]  83.19,42.67 270 top
R66  22R  [R0603_5MIL_DWS]  98.81,36.58 90 top
R67  NA  [R0603_5MIL_DWS]  116.71,2.29 90 top
RM1  RA1206_(4X0603)_4B8_22R  [R_MATRIX_4]  16.76,77.34 0 top
RM2  RA1206_(4X0603)_4B8_22R  [R_MATRIX_4]  20.95,77.85 270 top
RM3  RA1206_(4X0603)_4B8_22R  [R_MATRIX_4]  25.02,77.85 270 top
RM4  RA1206_(4X0603)_4B8_4.7k  [R_MATRIX_4]  83.69,50.67 180 top
RM5  RA1206_(4X0603)_4B8_22R  [R_MATRIX_4]  87.25,46.61 180 top
RM6  RA1206_(4X0603)_4B8_10k  [R_MATRIX_4]  36.45,55.37 0 top
SATA  SATA-PWA-07  [SATA-PWA-07]  6.48,35.81 90 top
SD/MMC  PSD006A-LT2-BA0  [SD_CARD]  14.48,65.79 90 bottom
SEARCH  SW-TAKT6  [SW-TAKT_6X3.5_SMD]  68.58,2.03 90 top
T1  BC846B  [SOT23]  26.8,47.24 270 top
U1  SY6280  [SOT23-5]  22.1,32.77 270 top
U2  SY6280  [SOT23-5]  22.1,21.46 270 top
U3  SY6280  [SOT23-5]  22.1,27.81 270 top
U4  RCLAMP0524P  [SLP2510P8]  117.47,31.37 270 top
U5  RCLAMP0524P  [SLP2510P8]  117.47,28.32 270 top
U6  RCLAMP0524P  [SLP2510P8]  117.47,25.27 270 top
U7  MP1482DS  [SOIC8]  37.97,46.61 180 top
U8  RTL8211CL-GR  [LQFP48]  97.79,45.72 180 top
U$5  [LOGO-OPENHARDWARE_8X8]  74.04,34.16 0 top
U$6  [OLIMEX1_V]  46.18,54.38 0 bottom
U$8  [OLIMEX1_V]  77.72,51.94 0 top
U$9  [PB]  64.39,31.5 0 top
U$10  [ESD_SYMBOL]  33.27,28.83 0 top
U$11  [RECYCLE_BIN1/8]  82.55,28.7 0 top
U$12  [ROHS]  43.05,29.46 0 top
UART0  HN1X3  [HN1X3]  123.95,3.81 0 top
UEXT1  GBH-254-SMT-10  [ML10_S]  54.61,97.16 0 top
UEXT2  GBH-254-SMT-10  [ML10_S]  34.29,97.16 0 top
USB_HOST  USB_TWO_LEVEL  [USB_TWO_LEVEL]  7.87,14.61 270 top
USB_OTG  USB-OTG  [USB_MINI_9PIN]  4.32,29.46 0 top
VGA_DB15-F  VGA15  [DB15-F_22MM]  128.91,74.3 90 top
VOL+  SW-TAKT6  [SW-TAKT_6X3.5_SMD]  28.57,2.03 90 top
VOL-  SW-TAKT6  [SW-TAKT_6X3.5_SMD]  41.91,2.03 90 top
VR1  NA(AP1231-2.8V)  [SOT-23-5]  21.46,63.37 270 top
VR2  AP1231-1.8V(SOT23-5)  [SOT-23-5]  25.27,71.88 90 top

## Tracks (layer width: path | path; a pad name or v marks a point on that pad's centre or on a via)
1.8V  (via drill 0.6)
  Top 0.203: CAM1.10 2.76,80.43 3.17,80.01 3.17,79.88 4.06,78.99
  Top 0.254: v8.38,75.82 7.62,76.58 4.57,76.58 4.06,77.09 4.06,78.99
  Top 0.508: 1.8V.P$1 2.79,75.44 4.19,75.44 v4.45,75.18
  Top 0.762: v8.38,75.82 8.89,75.82 9.4,76.33 C23.1
  Top 1.016: v21.72,70.1 22.48,70.87 22.48,70.93 | 22.48,70.93 C30.1 | 22.48,70.93 VR2.5
  Bottom 0.508: v4.45,75.18 7.75,75.18 v8.38,75.82
  Bottom 0.762: v8.38,75.82 8.76,75.44 11.94,75.44 13.97,73.41 14.61,73.41 17.78,70.23 21.59,70.23 v21.72,70.1
+5V  (via drill 0.6)
  Top 0.508: U3.5 23.68,28.76 23.88,28.96 | 30.48,40.64 5V_E_SATA.1 | 19.94,64.55 VR1.1 21.02,64.32 21.34,64.01 21.34,62.74 21.02,62.42 VR1.3 | U1.5 24.45,33.72 C1.1 | C12.1 25.09,22.41 U2.5
  Top 0.762: v87,19.3 A20-SOM-EVB_PLATFORM.LCD-1
  Top 1.016: GPIO-1.1 17.78,10.16 v18.29,10.67 19.05,11.43 19.05,17.27 19.68,17.91 v23.88,17.91 31.24,17.91 33.66,20.32 A20-SOM-EVB_PLATFORM.1-1 | v77.34,8 76.2,8 LCD_CON.1 | v40.77,93.6 43.18,96.01 v48.26,96.01 | v73.66,96.01 72.39,96.01 GPIO-3.1 72.39,91.19 v72.52,91.06 | GPIO-2.1 72.39,83.82 73.66,85.09 v73.66,85.98 | v85.72,75.18 85.72,73.28 86.36,72.64 86.36,71.63 87,70.99 A20-SOM-EVB_PLATFORM.3-1 v87,61.09 87,56.9 85.47,55.37 v74.55,55.37 | R56.1 R53.1 118.75,70.61 v117.86,69.72 | 23.88,28.96 C14.1 27.3,28.96 | v26.54,20.83 26.54,22.35 | 26.54,22.35 C12.1 | 26.54,22.35 26.54,24.77 27.3,25.53 27.3,28.96 | v31.37,40.64 30.48,40.64 | FET1.2 25.91,42.56 R20.1 25.27,44.96 v24.89,44.96 | v14.22,58.67 14.22,62.36 15.49,63.63 16.89,63.63 17.78,64.52 C29.1 18.45,64.55 19.94,64.55 | GPIO-4.1 29.21,83.19 v28.07,83.19 | v62.23,36.7 v31.37,36.7 29.72,36.7 27.3,34.29 27.3,34.16 | v89.53,63.63 v111.76,63.63 | v119.13,18.54 118.62,19.05 R26.2 R27.2 115.83,19.81 FUSE1.1 | 27.3,28.96 27.3,34.16 | 27.3,34.16 C1.1
  Bottom 1.016: 79.5,8 v77.34,8 20.95,8 v18.29,10.67 | 79.5,8 113.54,8 119.51,13.97 119.51,18.16 v119.13,18.54 | v87,19.3 86.61,18.92 81.66,18.92 79.5,16.76 79.5,8 | v40.77,93.6 30.1,93.6 26.54,90.04 26.54,83.95 27.3,83.19 v28.07,83.19 | v73.66,96.01 v48.26,96.01 | v72.52,91.06 72.52,87.12 v73.66,85.98 73.79,85.85 83.31,85.85 87.63,81.53 87.63,78.99 85.72,77.09 v85.72,75.18 | v26.54,20.83 24.89,20.83 23.88,19.81 v23.88,17.91 | v31.37,36.7 v31.37,40.64 29.21,40.64 v24.89,44.96 23.62,46.23 23.62,47.12 18.92,51.82 18.92,53.98 v14.22,58.67 | v62.23,36.7 62.23,43.05 v74.55,55.37 | v87,61.09 v89.53,63.63 | v111.76,63.63 v117.86,69.72
+5V_OTG_PWR  (via drill 0.6, 0.8)
  Top 0.508: USB_OTG.VBUS 7.57,31.06 7.87,31.37
  Top 1.016: v34.67,17.91 36.2,19.43 A20-SOM-EVB_PLATFORM.1-5 | 7.87,31.37 8.26,31.75 9.4,31.75 L1.1 9.78,31.88 10.16,31.5 C5.1 v11.3,32.64 | v29.21,19.18 28.7,19.68 v28.7,32.13
  Bottom 1.016: v29.21,19.18 29.21,18.92 30.23,17.91 v34.67,17.91 | v11.3,32.64 28.19,32.64 v28.7,32.13
+12V  (via drill 0.6, 0.8, 0.9)
  Top 1.016: v37.47,41.4 37.47,40.51 37.97,40.01 R37.1 | GPIO-4.25 59.69,79.38 59.05,78.74 v59.05,57.53 | v38.61,50.93 U7.2
  Top 1.524: v10.29,67.56 10.29,70.87 13.34,73.91 13.34,81.66 16,84.33 C44.+ 16,86.98 D1.C
  Top 1.676: 8.38,92.71 PWR.+ 8.38,89.92 | 8.38,89.92 8.38,88.9 | D1.C 8.78,89.52 8.38,89.92
  Bottom 1.016: v38.61,50.93 38.61,42.55 v37.47,41.4
  Bottom 1.524: v38.61,50.93 38.61,54.36 | 38.61,54.36 25.65,54.36 12.45,67.56 v10.29,67.56 | 38.61,54.36 39.5,54.36 42.67,57.53 v59.05,57.53
+15V  (via drill 0.6, 1)
  Top 0.762: R39.1 20.45,4.19 21.59,5.33 v21.59,9.27
  Top 1.016: A20-SOM-EVB_PLATFORM.2-1 60.33,19.05 62.23,17.14 v63.88,17.14 | 63.88,56.01 60.33,59.56 A20-SOM-EVB_PLATFORM.4-1
  Top 1.524: 63.88,46.61 63.88,56.01 | 5V_E.2 34.04,50.67 34.04,48.39 35.81,46.61 63.88,46.61 | v63.88,42.55 63.88,46.61
  Bottom 0.762: v21.59,9.27 21.72,9.14 62.23,9.14 66.17,13.08 66.17,14.86 v63.88,17.14
  Bottom 1.524: v63.88,17.14 v63.88,42.55
+24V  (via drill 0.6)
  Top 1.016: A20-SOM-EVB_PLATFORM.2-3 61.59,19.68 62.48,18.8 64.39,18.8 66.29,16.89 67.06,16.89
  Top 1.27: 67.06,16.89 67.69,16.26 v67.69,6.6 | LIPO_BAT.1 17.13,97.68 16.13,98.68 12.95,98.68 C49.2 v10.54,97.54
  Bottom 1.27: v10.54,97.54 5.33,92.33 5.33,90.37 1.02,86.06 1.02,8.38 4.06,5.33 12.19,5.33 13.46,6.6 v67.69,6.6
AVDD1  (via drill 0.6)
  Top 0.203: CAM1.4 3.07,79.23 3.56,78.74
  Top 0.254: 3.56,78.74 3.56,76.83 4.32,76.07 6.73,76.07 8.51,74.3 v8.76,74.3
  Top 0.762: v8.76,74.3 9.4,74.3 C26.1
  Top 1.016: C27.1 L9.1 v26.29,61.34
  Bottom 0.762: v26.29,61.34 26.04,61.59 22.99,61.59 19.56,65.02 19.56,66.93 14.22,72.26 13.59,72.26 11.56,74.3 v8.76,74.3
AVDD33  (via drill 0.6)
  Top 0.254: U8.41 103.37,44.97 104.39,43.94 104.39,40.51 v105.66,39.24 | U8.6 v98.04,51.82
  Top 0.762: v105.66,39.24 107.44,39.24 C35.2 | v98.04,51.82 C33.2 | v98.04,56.01 90.81,56.01 L11.2
  Top 1.016: C33.2 C34.2
  Bottom 0.762: v105.66,39.24 101.85,39.24 99.19,41.91 97.92,41.91 95,44.83 95,48.77 v98.04,51.82 v98.04,56.01
AVDD/DVDD(1.05V)  (via drill 0.6)
  Top 0.254: U8.40 103.1,44.47 103.89,43.69 103.89,39.75 105.28,38.35 106.68,38.35 106.93,38.1 | U8.3 99.54,52.93 C58.2 | U8.28 96.54,39.9 95.5,38.86 95,38.86 v94.74,38.61 | v100.84,38.61 100.54,38.91 U8.36 | U8.10 96.04,51.03 95.38,51.69 v94.74,51.69
  Top 0.508: C55.2 107.44,37.59 106.93,38.1
  Top 0.762: C55.2 107.57,37.34 108.33,36.58 v108.33,36.2 | C56.2 94.49,38.35 v94.74,38.61
  Top 1.016: 107.95,54.86 C52.2 | 106.93,54.86 C53.2 | v100.84,38.61 C57.2 | C58.2 100.2,52.96 102.31,55.07 102.41,55.07 100.2,57.28 v96.77,57.28 | v94.74,51.69 C54.2
  Top 2.032: 107.95,54.86 106.93,54.86 106.73,55.07 L14.2 102.41,55.07
  Bottom 1.016: v108.33,36.2 108.33,36.7 107.57,37.47 101.98,37.47 v100.84,38.61 v94.74,38.61 94.74,43.43 93.85,44.32 93.85,50.8 v94.74,51.69 96.77,53.72 v96.77,57.28
CLK125  (via drill 0.6)
  Top 0.254: v98.81,34.42 R66.1 | v114.68,60.45 114.3,60.83 114.3,62.74 112.52,64.52 108.97,64.52 v107.31,66.17
  Top 0.508: A20-SOM-EVB_PLATFORM.2-38 83.19,26.1 v83.44,26.35
  Top 1.016: v110.62,78.61 110.49,78.74 GPIO-2.31
  Bottom 0.254: v83.44,26.35 84.14,25.65 87.12,25.65 93.98,32.51 93.98,34.8 94.49,35.31 97.92,35.31 v98.81,34.42 99.69,33.53 101.22,33.53 103,35.31 108.71,35.31 112.01,38.61 121.16,38.61 123.19,40.64 123.19,51.94 v114.68,60.45 | v107.31,66.17 107.44,66.29 107.44,70.74 108.71,72.01 108.71,75.31 110.62,77.22 v110.62,78.61
DVDD33  (via drill 0.6)
  Top 0.254: U8.37 101.98,42.86 101.98,41.53 | U8.21 91.08,44.47 89.53,42.93 89.53,41.02 88.77,40.26 | U8.15 91.72,47.47 v91.31,47.88
  Top 0.508: 104.14,38.1 104.14,38.48 103,39.62 103,40.51 101.98,41.53 | v106.93,36.2 C43.2 | 88.14,38.48 87.63,38.48 87.38,38.23 87.38,36.7 R57.1 | 88.14,38.48 93.09,38.48 v93.34,38.73 | 88.14,38.48 C41.2
  Top 0.762: C41.2 88.77,40.26
  Top 1.016: C43.2 R43.1 104.14,38.1 | v91.31,49.66 89.79,49.66 | 89.79,49.66 C38.2 | 89.79,49.66 C37.2 89.79,52.7 L12.2
  Bottom 0.762: v106.93,36.2 101.6,36.2 100.33,37.47 94.23,37.47 93.34,38.35 v93.34,38.73 93.34,43.18 91.31,45.21 v91.31,47.88 v91.31,49.66
EMDC  (via drill 0.6)
  Top 0.254: 83.19,21.84 82.68,22.35 82.04,22.35 81.41,22.99 v81.41,23.24 | U8.30 97.54,39.37 95.89,37.72 95.89,35.43 v94.87,34.42
  Top 0.508: A20-SOM-EVB_PLATFORM.2-37 83.19,21.84
  Bottom 0.254: v81.41,23.24 82.42,24.26 82.93,24.26 83.82,25.15 87.38,25.15 94.87,32.64 v94.87,34.42
EMDIO  (via drill 0.6)
  Top 0.254: 84.45,21.84 84.58,21.97 84.58,23.24 84.2,23.62 83.06,23.62 v82.68,23.24 | U8.31 98.04,38.98 97.28,38.23 | R49.1 96.39,36.58 96.39,34.67 v96.14,34.42
  Top 0.508: A20-SOM-EVB_PLATFORM.2-39 84.45,21.84 | R49.1 97.28,38.23
  Bottom 0.254: v82.68,23.24 84.07,24.64 87.63,24.64 96.14,33.15 v96.14,34.42
ENTER_BUT
  Top 1.016: ENTER.P$2 113.28,1.4 R18.2
EPHY-RST#  (via drill 0.6)
  Top 0.254: 89.92,35.31 89.41,34.8 87.63,34.8 86.23,36.2 84.2,36.2 v83.31,37.08 79.76,40.64 79.76,49.02 v79.63,49.15
  Top 0.762: A20-SOM-EVB_PLATFORM.2-40 84.45,25.65 84.58,25.78 v84.58,26.92
  Top 1.016: GPIO-2.33 113.03,80.64 v114.17,80.64 | 89.92,35.31 R64.1
  Bottom 0.254: v114.17,80.64 113.03,79.5 113.03,69.72 106.68,63.37 96.65,63.37 89.28,56.01 87,56.01 80.14,49.15 v79.63,49.15 | v84.58,26.92 83.69,27.81 83.69,36.7 v83.31,37.08
ERXCK  (via drill 0.6)
  Top 0.254: 80.64,21.72 80.01,22.35 79.63,22.35 v78.87,23.11
  Top 0.508: A20-SOM-EVB_PLATFORM.2-33 80.64,21.72 | 85.85,43.56 85.09,42.8 v85.09,41.4
  Top 1.016: 85.85,43.56 R42.2
  Bottom 0.254: v85.09,41.4 84.71,41.02 79.63,41.02 76.07,37.47 76.07,35.18 75.18,34.29 75.18,26.54 77.72,24 77.98,24 v78.87,23.11
ERXD0  (via drill 0.6)
  Top 0.254: v73.15,18.67 73.15,18.92 74.3,20.07
  Top 0.762: 74.3,20.07 A20-SOM-EVB_PLATFORM.2-23 | v85.22,47.88 RM5.4.2
  Bottom 0.254: v85.22,47.88 82.68,47.88 72.14,37.34 72.14,25.02 73.15,24 v73.15,18.67
ERXD1  (via drill 0.6)
  Top 0.254: v74.42,18.67 74.42,18.92 75.56,20.07 | v84.2,46.99 85.85,46.99
  Top 0.508: 85.85,46.99 RM5.3.2
  Top 0.762: 75.56,20.07 A20-SOM-EVB_PLATFORM.2-25
  Bottom 0.254: v74.42,18.67 73.66,19.43 73.66,24.26 72.64,25.27 72.64,37.08 82.55,46.99 v84.2,46.99
ERXD2  (via drill 0.6)
  Top 0.254: v75.69,18.92 76.83,20.07 | 85.85,46.23 84.71,46.23 84.2,45.72 v83.95,45.72
  Top 0.508: 85.85,46.23 RM5.2.2
  Top 0.762: 76.83,20.07 A20-SOM-EVB_PLATFORM.2-27
  Bottom 0.254: v75.69,18.92 74.17,20.45 74.17,24.51 73.15,25.53 73.15,36.83 82.04,45.72 v83.95,45.72
ERXD3  (via drill 0.6)
  Top 0.254: 78.11,21.72 77.6,22.23 75.56,22.23 v75.06,22.73
  Top 0.508: 78.11,21.72 A20-SOM-EVB_PLATFORM.2-29
  Top 0.762: v85.22,45.34 RM5.1.2
  Bottom 0.254: v85.22,45.34 84.71,44.83 81.92,44.83 73.66,36.58 73.66,25.78 75.06,24.38 v75.06,22.73
ERXDV  (via drill 0.6)
  Top 0.254: 79.38,21.72 78.87,22.23 78.49,22.23 v77.6,23.11 | v91.06,51.69 90.81,51.94 90.81,53.85 91.06,54.1 | v75.18,35.81 v75.18,41.66
  Top 0.508: 79.38,21.72 A20-SOM-EVB_PLATFORM.2-31 | 91.06,54.1 R41.2
  Bottom 0.254: v77.6,23.11 77.6,23.37 74.68,26.29 74.68,35.31 v75.18,35.81 | v91.06,51.69 90.17,50.8 84.84,50.8 75.69,41.66 v75.18,41.66
ESC_BUT
  Top 0.508: R17.2 101.73,1.4 103.5,3.17 R18.1
  Top 1.016: ESC.P$2 99.95,1.4 R17.2
ETXCK  (via drill 0.4, 0.6)
  Top 0.254: U8.22 91.85,43.97 v91.44,43.56
  Top 0.762: v82.17,26.35 81.92,26.1 A20-SOM-EVB_PLATFORM.2-36
  Bottom 0.254: v91.44,43.56 92.58,42.42 92.58,39.24 91.82,38.48 83.44,38.48 81.79,36.83 81.79,26.73 v82.17,26.35
ETXD0  (via drill 0.4, 0.6)
  Top 0.254: 74.3,23.88 74.55,23.62 75.82,23.62 v76.33,23.11 | U8.23 92.49,43.47 91.69,42.67 v90.68,42.67
  Top 0.508: A20-SOM-EVB_PLATFORM.2-24 74.3,23.88
  Bottom 0.254: v76.33,23.11 76.33,23.88 74.17,26.04 74.17,36.32 79.38,41.53 83.95,41.53 85.09,42.67 v90.68,42.67
ETXD1  (via drill 0.4, 0.6)
  Top 0.254: U8.24 92.88,42.97 91.95,42.04 91.19,42.04 90.81,41.66 v90.42,41.66
  Top 0.508: A20-SOM-EVB_PLATFORM.2-26 75.56,26.42 v76.07,26.92
  Bottom 0.254: v90.42,41.66 89.28,40.51 79.88,40.51 76.58,37.21 76.58,27.43 v76.07,26.92
ETXD2  (via drill 0.4)
  Top 0.254: U8.25 94.93,41.53 91.44,41.53 v90.3,40.39
  Top 0.762: A20-SOM-EVB_PLATFORM.2-28 76.83,26.04 v77.09,26.29
  Bottom 0.254: v90.3,40.39 89.92,40.01 80.14,40.01 77.09,36.96 v77.09,26.29
ETXD3  (via drill 0.4)
  Top 0.254: U8.26 95.54,40.42 95.25,40.13 92.2,40.13 v91.69,40.64
  Top 0.508: A20-SOM-EVB_PLATFORM.2-30 78.23,25.02 v78.23,26.29
  Bottom 0.254: v91.69,40.64 90.55,39.5 80.39,39.5 77.6,36.7 77.6,27.81 78.23,27.18 v78.23,26.29
ETXEN  (via drill 0.4, 0.6)
  Top 0.254: U8.27 96.04,40.16 95.5,39.62 91.82,39.62 v91.69,39.5
  Top 0.508: A20-SOM-EVB_PLATFORM.2-32 79.38,25.78 79.25,25.91 v79.25,26.92
  Bottom 0.254: v91.69,39.5 91.19,38.99 80.64,38.99 78.11,36.45 78.11,28.07 v79.25,26.92
GND  (via drill 0.6)
  Top 0.203: CAM1.2 2.71,78.83 3.05,78.49 3.05,77.47 v2.54,76.96 | CAM1.1 6.14,78.83 5.84,79.12 5.21,79.12 v4.45,79.88 | CAM1.24 1.36,83.23 1.02,83.57 | CAM1.23 7.66,83.23 8.64,84.2 11.05,84.2 11.3,83.95 | CAM1.15 11.39,81.63 11.56,81.79
  Top 0.254: HDMI.17 128.98,21.27 129.03,21.21 | HDMI.11 128.9,24.27 129.03,24.13 | HDMI.8 128.92,25.77 129.03,25.65 | HDMI.5 128.94,27.27 129.03,27.18 | HDMI.2 128.97,28.77 129.03,28.7 | U8.47 103.6,47.97 104.65,49.02 104.65,49.4 | U8.33 99.04,39.01 99.82,38.23 | U8.7 97.54,51.05 96.9,51.69 96.14,51.69 95.63,52.2 95.63,54.74 | U8.20 90.82,44.97 89.03,43.18 89.03,41.27 88.9,41.15 86.36,41.15 | 26.67,71.88 26.54,71.75 25.78,71.75 25.27,71.25 v25.27,70.23
  Top 0.381: v119.63,31.5 119.51,31.37 U4.8 U4.3 | v119.63,28.19 119.51,28.32 U5.8 U5.3 | U6.3 U6.8 119.76,25.27 v120.4,24.64
  Top 0.508: U1.2 19.68,32.77 C2.2 | R2.1 21.46,30.61 22.1,31.24 22.1,32.77 | C50.1 105.66,47.75 105.03,47.75 | 99.82,38.23 99.82,36.7 C57.1 | v86.23,51.69 86.23,51.82 85.09,52.96 82.17,52.96 81.92,52.7 81.92,50.29 | 22.1,32.77 v22.1,34.42 | 18.8,21.46 U2.2 | C16.2 19.05,27.05 19.81,27.81 U3.2 25.27,27.81 C14.2 | 1.02,83.57 1.02,84.58 2.54,86.11 2.54,86.74 | C30.2 23.24,73.66 27.94,73.66 28.19,73.41 | VR2.2 26.67,71.88 27.56,71.88 C31.2 | 12.32,83.95 11.3,83.95 | 11.56,81.79 12.32,82.55 12.32,83.95 | 7.37,86.28 7.7,86.61 11.18,86.61 12.32,85.47 12.32,83.95 | 22.1,32.77 24.51,32.77 C1.2 | USB_OTG.GND 8.84,27.86 L2.1 | R65.2 84.58,40.39 86.36,40.39
  Top 0.762: R28.2 120.78,19.18 123.58,19.18 125.29,17.46 125.35,17.46 | 104.65,49.4 105.54,50.29 105.92,50.29 106.3,50.67 108.97,50.67 | C37.1 87.88,51.05 86.87,51.05 v86.23,51.69 | R8.1 22.1,22.86 21.21,23.75 R10.1 | v15.49,59.69 15.49,61.85 16,62.36 18.03,62.36 C29.2 19.05,63.37 VR1.2 | C26.2 11.68,74.3 8.51,71.12 v8.51,68.2
  Top 1.016: C47.2 C39.2 31.62,46.86 | 31.62,46.86 C46.2 C40.2 | A20-SOM-EVB_PLATFORM.1-2 v33.66,30.99 | 17.02,31.88 R3.1 | 17.02,31.88 R4.1 13.08,31.88 | 17.02,31.88 C2.2 | R10.1 R11.1 C13.2 C16.2 v17.65,27.05 C15.2 | LCD_CON.4 78.74,15.49 76.2,15.49 LCD_CON.2 76.2,11.81 74.93,10.54 v74.93,6.73 | A20-SOM-EVB_PLATFORM.2-2 60.33,25.4 61.59,25.4 | 61.59,25.4 A20-SOM-EVB_PLATFORM.2-4 | 61.59,25.4 61.59,26.54 69.6,34.54 v85.85,34.54 | 31.75,86.23 GPIO-4.4 | 29.21,86.23 v30.48,86.23 31.75,86.23 | 29.21,86.23 GPIO-4.2 | 31.75,86.23 31.75,85.6 33.02,84.33 v33.02,80.9 33.02,74.42 | UEXT2.2 29.21,101.85 v27.3,101.85 | UEXT1.2 49.53,101.85 v50.8,101.85 | GPIO-3.4 74.93,97.41 72.39,97.41 | 72.39,97.41 GPIO-3.2 | A20-SOM-EVB_PLATFORM.4-2 60.33,78.11 60.96,78.74 60.96,84.45 59.69,85.72 GPIO-4.26 59.69,88.77 62.74,88.77 63.75,89.79 70.61,89.79 | v87,76.45 A20-SOM-EVB_PLATFORM.3-2 | 125.09,67.18 VGA_DB15-F.GND1 120.57,61.8 117.28,65.09 FET4.2 | 125.09,67.18 128.14,67.18 129.67,68.71 129.67,80.14 | 125.09,67.18 125.09,69.34 | 125.09,69.34 VGA_DB15-F.10 | VGA_DB15-F.5 122.69,69.34 125.09,69.34 | VGA_DB15-F.8 VGA_DB15-F.7 VGA_DB15-F.6 125.47,80.14 129.67,80.14 | C50.1 C51.1 C48.1 R52.1 108.97,50.67 108.97,52.58 | C62.1 C64.1 | 109.09,40.64 109.35,40.39 C35.1 C55.1 112.27,37.59 | R60.2 C59.1 C61.1 113.54,43.81 v112.27,42.55 112.27,37.59 | 108.97,52.58 C52.1 C53.1 | 112.27,34.42 112.27,37.59 | v109.6,52.96 109.22,52.58 108.97,52.58 | C57.1 v100.84,34.42 104.14,34.42 | 105.66,34.42 104.14,34.42 | 105.66,34.42 C43.1 | 104.14,34.42 R44.1 | 112.27,34.42 105.66,34.42 | R40.2 C54.1 95.63,54.74 C34.1 C33.1 C58.1 v99.57,56.01 | C42.2 86.36,41.15 86.36,40.39 C41.1 86.36,37.59 v85.85,37.08
  Top 1.016: C56.1 C65.1 v92.96,34.54 | C37.1 C38.1 | FET5.2 117.2,75.44 v118.11,75.44 | C10.2 v17.65,22.23 C11.2 18.8,21.46 C9.2 R9.1 18.8,18.92 17.78,17.91 GPIO-1.2 17.78,12.95 v14.1,9.27 14.1,3.94 12.06,1.91 GND_PIN.P$1 | C14.2 25.91,26.04 v25.15,25.27 C12.2 | L2.1 9.65,27.05 v13.08,27.05 C5.2 13.08,31.88 | 3.56,44.07 3.56,40.31 SATA.1 8.84,40.31 13.08,36.07 C3.2 C4.2 13.08,31.88 | 3.56,44.07 3.56,47.93 SATA.7 9.71,47.93 v9.78,48.01 | SATA.4 3.56,44.12 3.56,44.07 | 5V_SATA_PWR.2 17.67,46.97 19.94,44.7 C22.1 C21.1 C25.2 R23.1 25.64,46.35 T1.2 | R46.2 v33.4,46.86 31.62,46.86 | v36.07,50.93 U7.4 | v33.53,41.78 R45.2 | 21.21,58.67 16.13,58.67 15.49,59.31 v15.49,59.69 | 21.21,58.67 v21.21,56.52 | 21.21,58.67 22.35,58.67 22.61,58.93 22.61,59.94 23.11,60.45 v24.51,60.45 C28.2 | v41.53,40.01 C45.2 | v38.48,60.07 37.47,60.07 C60.1 C63.1 | 28.32,64.26 v28.32,66.29 | C31.2 28.19,73.41 32,73.41 33.02,74.42 | v31.37,60.07 29.59,61.85 29.59,63.12 28.45,64.26 28.32,64.26 | 28.32,64.26 C27.2 | 33.02,74.42 A20-SOM-EVB_PLATFORM.5-2 | C26.2 C23.2 C24.2 | 21.08,84.84 21.08,86.23 29.21,86.23 | 72.39,87.76 72.39,89.79 70.61,89.79 | GPIO-2.4 74.93,87.76 v73.79,87.76 72.39,87.76 | 72.39,87.76 GPIO-2.2 | 70.61,89.79 v70.61,97.41 72.39,97.41 | A20-SOM-EVB_PLATFORM.LCD-4 88.27,25.4 87.12,25.4 | A20-SOM-EVB_PLATFORM.LCD-2 87,25.4 87.12,25.4 | v87.12,26.92 87.12,25.4 | 129.03,17.46 129.03,21.21 129.03,24.13 129.03,25.65 v129.03,26.54 129.03,27.18 129.03,28.7 129.03,32.06 | PWR_LED.C 19.68,2.41 v20.07,2.03 VOL+.P$1 | v39.37,2.03 VOL-.P$1 | v52.7,2.03 MENU.P$1 | v66.04,2.03 SEARCH.P$1 | v79.38,2.03 HOME.P$1 | v92.71,2.03 ESC.P$1
  Top 1.016: v106.05,2.03 ENTER.P$1 | 125.35,32.06 123,34.42 112.27,34.42 | VGA_DB15-F.GND2 129.67,82.22 129.67,80.14 | PWR.-- 5.08,88.65 5.97,88.65 | PWR.- 3.81,90.73 3.81,91.69 | R59.1 R61.1 v113.54,53.85
  Top 1.524: 6.22,94.11 7.87,95.76 C49.1 13.46,95.76 | 13.46,95.76 D1.A 13.46,93.22 21.08,85.6 21.08,84.84 C44.- | LIPO_BAT.2 14.73,97.03 13.46,95.76
  Top 1.676: 7.37,86.28 PWR.-- 3,86.28 2.54,86.74 1.88,87.4 PWR.- 1.88,93.09 2.9,94.11 6.22,94.11
  Top 2.032: 125.35,17.46 HDMI.SH4 129.03,17.46 HDMI.SH3 | HDMI.SH2 129.03,32.06 HDMI.SH1 125.35,32.06
  Bottom 0.508: 29.78,60.07 SD/MMC.6
  Bottom 0.762: SD/MMC.SH2 8.23,80.29 7.24,81.28 5.21,81.28 4.7,80.77 4.45,80.77 | 2.54,80.77 4.45,80.77 | 4.45,80.77 v4.45,79.88
  Bottom 1.016: 74.93,2.03 v74.93,6.73 | 120.4,26.54 v120.4,24.64 | 120.4,26.54 120.4,27.43 v119.63,28.19 v119.63,31.5 | v129.03,26.54 120.4,26.54 | 87.12,34.54 v85.85,34.54 v85.85,37.08 | 125.09,61.72 125.09,57.28 | 125.09,61.72 VGA_DB15-F.GND1 | v87,76.45 88.9,78.36 88.9,82.17 83.95,87.12 74.42,87.12 v73.79,87.76 | v100.84,34.42 99.06,36.2 94.11,36.2 92.96,35.05 v92.96,34.54 87.12,34.54 | v86.23,51.69 88.14,53.59 90.55,53.59 95.5,58.55 99.57,58.55 | 99.57,58.55 v99.57,56.01 | v118.11,75.44 118.11,76.45 121.92,80.26 124.6,80.26 VGA_DB15-F.6 | USB_HOST.2.4 USB_HOST.1.4 12.26,11.11 v14.1,9.27 | v17.65,22.23 17.65,25.27 | 17.65,25.27 v17.65,27.05 v13.08,27.05 | 9.78,52.09 v9.78,48.01 15.86,48.01 5V_SATA_PWR.2 17.41,46.97 18.41,45.97 18.41,43.94 17.65,43.18 | 33.4,50.93 31.65,52.68 SD/MMC.WP 25.05,52.68 v21.21,56.52 | 33.4,50.93 v33.4,46.86 33.4,41.91 v33.53,41.78 35.31,40.01 v41.53,40.01 | 33.4,50.93 v36.07,50.93 | 9.78,52.09 SD/MMC.SH1 | 9.78,52.09 9.78,55.75 7.37,58.17 7.37,61.59 | v15.49,59.69 13.59,61.59 7.37,61.59 | v24.51,60.45 24.89,60.07 29.78,60.07 v31.37,60.07 v38.48,60.07 | v28.32,66.29 28.89,66.87 SD/MMC.3 | LIPO_BAT.2 15.13,97.55 19.43,101.85 v27.3,101.85 v50.8,101.85 66.17,101.85 v70.61,97.41 | 7.37,68.2 v8.51,68.2 | 7.37,61.59 7.37,68.2 | 7.37,68.2 4.32,68.2 v2.54,69.98 v2.54,76.96 2.54,80.77 2.54,85.09 3.73,86.28 | 87.12,34.54 v87.12,26.92 | HDMI.SH4 126.86,12.31 116.59,2.03 v108.58,2.03 v106.05,2.03 v92.71,2.03 v79.38,2.03 74.93,2.03 | GND_PIN.P$1 19.3,1.27 v20.07,2.03 v39.37,2.03 v52.7,2.03 v66.04,2.03 74.93,2.03 | 99.57,58.55 109.6,58.55 | 109.6,58.55 v109.6,52.96 | PWR.-- 5.08,88.14 5.97,88.14
  Bottom 1.016: PWR.- 3.68,90.73 3.68,91.69 | 109.6,58.55 112.78,61.72 125.09,61.72 | 17.65,25.27 v25.15,25.27
  Bottom 1.676: 3.73,86.28 PWR.-- 6.99,86.28 | 1.88,92.71 PWR.- 1.88,89.41
  Bottom 2.032: HDMI.SH4 125.6,17.46 | HDMI.SH3 131.57,17.46 | HDMI.SH1 125.6,32.06 | HDMI.SH2 131.57,32.06
  other vias: 127,53.85 92.71,9.53 95.25,9.53 97.79,9.4 100.33,9.4 104.78,49.66 105.66,57.02 95.5,57.28 115.95,84.96 40.89,97.28 42.29,97.28 48.01,91.44 46.74,91.44 26.92,93.22 24.64,91.82 35.56,80.9 2.79,62.1 2.79,60.71 11.18,61.85 12.45,61.85 62.23,32.89 44.58,48.13 45.85,48.13 43.31,48.13 42.04,48.13 39.88,57.02 43.18,55.75 44.45,55.75 67.31,57.53 74.04,57.53 69.98,57.53 67.44,60.33 64.9,60.33 76.71,61.09 52.83,64.77 56.39,55.75 51.44,67.06 67.06,40.01 75.31,46.23 71.75,10.03 66.17,10.92 64.77,13.34 79.5,33.27 114.3,34.29 120.65,34.29 99.06,26.67 120.02,53.72 123.44,37.72 127.25,37.72 83.31,56.64 113.54,26.8 123.19,34.29 125.73,34.29 111.76,34.29 109.22,34.29 93.98,26.67 82.8,27.43 82.8,33.27 73.91,14.73 118.75,4.19 92.71,5.21 97.79,5.21
  pour Top (isolate 0.254): 137.16,105.41 -2.54,105.41 -2.54,-2.54 137.16,-2.54 137.16,38.1 116.84,38.1 116.84,53.34 137.16,53.34
  pour Bottom (isolate 0.254): -5.08,-5.08 139.7,-5.08 139.7,38.1 116.84,38.1 116.84,53.34 139.7,53.34 139.7,107.95 -5.08,107.95
GNDA  (via drill 0.6)
  Top 0.508: v15.62,54.48 15.88,54.23 20.32,54.23 21.21,53.34 C7.1
  Top 0.762: 34.92,26.67 A20-SOM-EVB_PLATFORM.1-4 | GPIO-1.4 v20.32,16.64 | v35.05,26.67 34.92,26.67 | 34.92,26.67 34.92,32.64 v32.64,34.92 | MIC_IN.5 6.21,66.56 8.76,64.01 v8.76,58.8
  Top 1.016: C8.1 C6.1 C7.1
  Bottom 0.762: v35.05,26.67 35.05,26.42 30.61,21.97 24.38,21.97 20.32,17.91 v20.32,16.64 | v32.64,34.92 30.73,34.92 29.72,35.94 29.72,37.72 21.97,45.47 21.97,46.35 17.27,51.05 17.27,53.09 15.88,54.48 v15.62,54.48 15.49,54.61 12.7,54.61 8.76,58.55 v8.76,58.8
GPIO1  (via drill 0.6)
  Top 0.508: v93.47,77.85 95.25,79.63 GPIO-2.19 | v82.68,63.12 82.68,68.07 81.92,68.83
  Top 0.762: 81.92,68.83 A20-SOM-EVB_PLATFORM.4-35
  Bottom 0.254: v93.47,77.85 91.44,77.85 90.68,77.09 90.42,77.09 86.11,72.77 86.11,67.06 82.68,63.63 v82.68,63.12
GPIO2  (via drill 0.6)
  Top 0.254: v92.58,76.96 95.63,76.96 97.79,79.12
  Top 0.508: v83.95,63.63 83.95,68.2 83.19,68.96
  Top 0.762: 83.19,68.96 A20-SOM-EVB_PLATFORM.4-37
  Top 1.016: 97.79,79.12 GPIO-2.21
  Bottom 0.254: v92.58,76.96 91.31,76.96 90.93,76.58 90.68,76.58 86.61,72.52 86.61,66.8 83.95,64.14 v83.95,63.63
GPIO3  (via drill 0.6)
  Top 0.254: v91.69,76.07 96.52,76.07 99.69,79.25
  Top 0.508: v85.22,64.14 85.22,68.2 84.45,68.96
  Top 0.762: 84.45,68.96 A20-SOM-EVB_PLATFORM.4-39
  Top 1.016: 99.69,79.25 100.33,79.88 GPIO-2.23
  Bottom 0.254: v91.69,76.07 90.93,76.07 88.39,73.53 88.39,72.01 87.12,70.74 87.12,66.55 85.22,64.64 v85.22,64.14
HCEC  (via drill 0.6)
  Top 0.203: 116.46,26.27 U6.1 U6.10 120.92,26.27 121.16,26.04
  Top 0.254: v73.28,15.88 72.9,16.26 71.75,16.26 68.58,19.43 68.2,19.43 67.94,19.68 | HDMI.13 123.93,23.27 121.16,26.04 | 116.46,26.27 115.97,26.27 v115.82,26.42
  Top 0.762: 67.94,19.68 A20-SOM-EVB_PLATFORM.2-13
  Bottom 0.254: v73.28,15.88 74.17,16.76 74.8,16.76 77.09,19.05 78.23,19.05 80.52,21.34 84.2,21.34 87,24.13 87.88,24.13 88.77,25.02 102.74,25.02 103.25,25.53 113.54,25.53 114.43,26.42 v115.82,26.42
HDMI_5V_SOURCE  (via drill 0.6)
  Top 0.254: HDMI.18 123.76,20.77 v123.7,20.83
  Top 1.016: FUSE1.2 114.42,21.21 v113.92,21.21
  Bottom 1.016: v123.7,20.83 114.3,20.83 v113.92,21.21
HHPD  (via drill 0.6)
  Top 0.203: 116.46,24 116.73,24.27 U6.5 U6.6 118.73,24.27 119,24
  Top 0.254: v78.23,17.14 77.6,17.78 72.52,17.78 71.75,18.54 71.75,18.8 | HDMI.19 124.53,20.27 124.21,19.94 123.06,19.94 120.78,22.23 | v114.81,23.75 116.2,23.75 116.46,24 | 119,24 120.78,22.23 | 120.78,22.23 120.57,22.02
  Top 0.508: 71.75,18.8 A20-SOM-EVB_PLATFORM.2-19
  Top 0.762: 120.57,22.02 R28.1
  Bottom 0.254: v78.23,17.14 78.61,17.53 78.87,17.53 78.99,17.53 81.28,19.81 84.96,19.81 86.74,21.59 88.27,21.59 88.9,22.23 88.9,22.86 89.53,23.5 103.63,23.5 104.14,24 114.55,24 v114.81,23.75
HOME_BUT  (via drill 0.6)
  Top 0.254: v72.01,11.3 72.9,10.41 72.9,5.97 74.8,4.06 89.28,4.06 90.17,3.17
  Top 0.508: R16.2 88.39,1.4 90.17,3.17 R17.1
  Top 1.016: v107.95,84.84 GPIO-2.30 | HOME.P$2 86.61,1.4 R16.2
  Bottom 0.254: v107.95,84.84 108.71,84.07 108.71,77.6 106.43,75.31 106.43,67.44 103.89,64.9 95.89,64.9 88.52,57.53 82.55,57.53 71.63,46.61 71.63,24.77 72.64,23.75 72.64,19.68 72.01,19.05 v72.01,11.3
HPCOM  (via drill 0.6)
  Top 0.254: 41.27,26.67 v41.27,33.02
  Top 0.762: 41.27,26.67 A20-SOM-EVB_PLATFORM.1-14 41.27,23.75 v41.02,23.5 | R7.2 v15.11,50.16 14.1,49.15 L5.1
  Top 1.016: GPIO-1.14 33.02,15.11 v34.16,15.11
  Bottom 0.254: v34.16,15.11 37.59,15.11 39.37,16.89 39.37,18.8 41.02,20.45 v41.02,23.5 | v15.11,50.16 15.49,50.16 20.19,45.47 20.19,44.58 27.94,36.83 27.94,35.05 29.97,33.02 37.85,33.02 38.23,32.64 40.89,32.64 v41.27,33.02
HPOUTL  (via drill 0.6)
  Top 0.254: 40.01,26.67 v40.01,33.53
  Top 0.508: A20-SOM-EVB_PLATFORM.1-12 40.01,24.13 39.75,23.88 v39.75,23.5
  Top 0.762: A20-SOM-EVB_PLATFORM.1-12 40.01,26.67
  Top 1.016: GPIO-1.12 30.48,15.11 v31.62,15.11 | L4.1 v14.99,53.21 R6.2
  Bottom 0.254: v31.62,15.11 32.51,16 37.72,16 38.86,17.14 38.86,19.05 39.75,19.94 v39.75,23.5 | v40.01,33.53 39.12,34.42 38.23,34.42 37.85,34.04 30.48,34.04 28.96,35.56 28.96,37.34 21.21,45.09 21.21,45.97 16.51,50.67 16.51,51.69 v14.99,53.21
HPOUTR  (via drill 0.6)
  Top 0.254: v38.73,26.67 v38.73,33.53
  Top 0.762: v38.73,26.67 A20-SOM-EVB_PLATFORM.1-10
  Top 1.016: GPIO-1.10 27.94,15.49 v29.08,15.49 | R5.2 v14.99,51.69 14.22,51.69 L3.1
  Bottom 0.254: v29.08,15.49 30.1,16.51 37.47,16.51 38.35,17.4 38.35,19.3 38.73,19.68 v38.73,26.67 | v14.99,51.69 16,50.67 16,50.42 20.7,45.72 20.7,44.83 28.45,37.08 28.45,35.31 30.23,33.53 v38.73,33.53
HSCL  (via drill 0.6)
  Top 0.203: 120.9,25.53 120.66,25.77 U6.9 U6.2 116.45,25.77 116.2,25.53
  Top 0.254: v74.68,15.88 73.79,16.76 72.01,16.76 69.22,19.56 69.22,19.81 | HDMI.15 124.17,22.27 120.9,25.53 | v114.81,25.53 116.2,25.53
  Top 0.508: 69.22,19.81 A20-SOM-EVB_PLATFORM.2-15
  Top 1.016: v118.62,22.73 R26.1